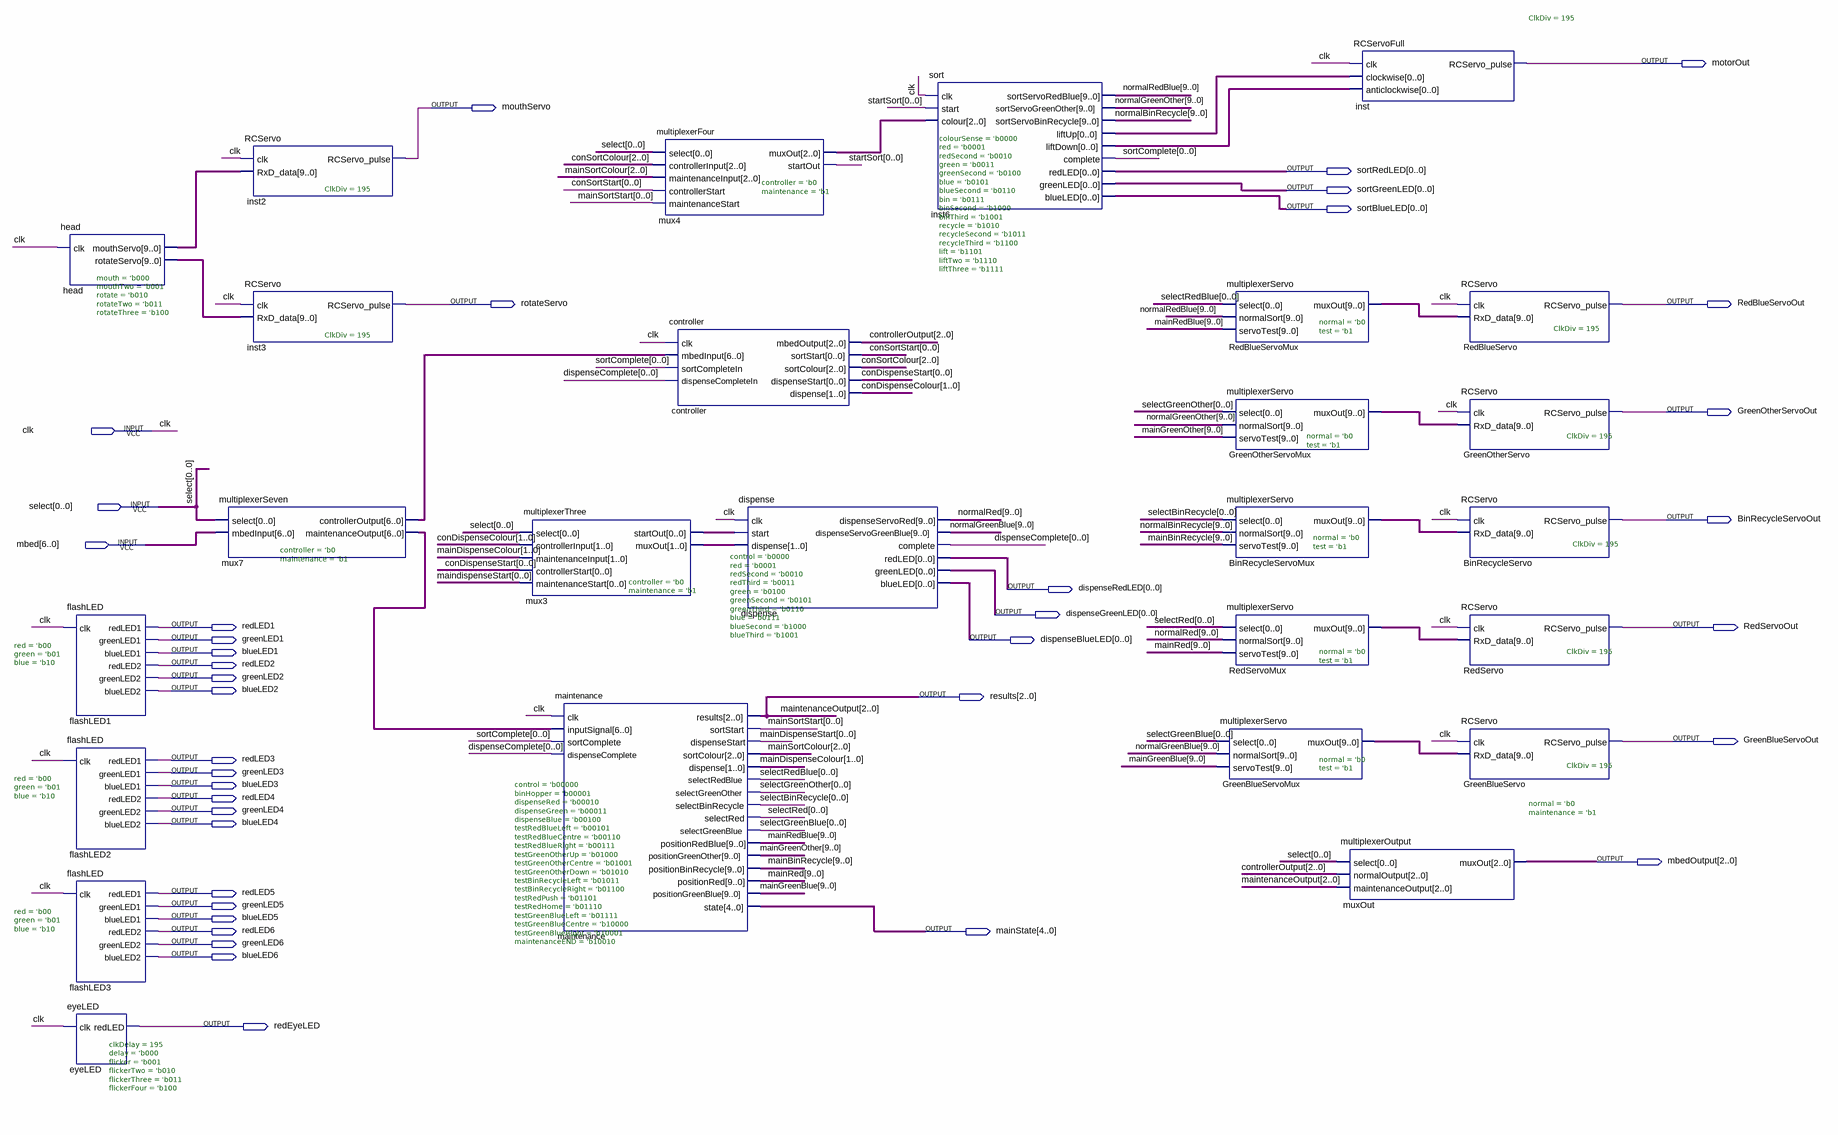
[diagram p0: schematic sheet]
// Quartus schematic System.bdf as structural Verilog: 26 symbols, 39 pins
module System (
  input  clk,
  input  [0:0] select,
  input  [6:0] mbed,
  output motorOut,
  output mouthServo,
  output [0:0] sortRedLED,
  output [0:0] sortGreenLED,
  output [0:0] sortBlueLED,
  output rotateServo,
  output RedBlueServoOut,
  output GreenOtherServoOut,
  output BinRecycleServoOut,
  output [0:0] dispenseRedLED,
  output [0:0] dispenseGreenLED,
  output redLED1,
  output RedServoOut,
  output greenLED1,
  output [0:0] dispenseBlueLED,
  output blueLED1,
  output redLED2,
  output greenLED2,
  output blueLED2,
  output [2:0] results,
  output GreenBlueServoOut,
  output redLED3,
  output greenLED3,
  output blueLED3,
  output redLED4,
  output greenLED4,
  output blueLED4,
  output [2:0] mbedOutput,
  output redLED5,
  output greenLED5,
  output blueLED5,
  output redLED6,
  output [4:0] mainState,
  output greenLED6,
  output blueLED6,
  output redEyeLED
);

  wire inst6_liftdown, inst6_liftup, mux3_startout;
  wire [0:0] conDispenseStart, conSortStart, dispenseComplete, maindispenseStart, mainSortStart,
       selectBinRecycle, selectGreenBlue, selectGreenOther, selectRed, selectRedBlue, sortComplete, startSort;
  wire [1:0] conDispenseColour, mainDispenseColour, mux3_muxout;
  wire [2:0] conSortColour, controllerOutput, mainSortColour, mux4_muxout;
  wire [6:0] mux7_controlleroutput, mux7_maintenanceoutput;
  wire [9:0] BinRecycleServoMux_muxout, GreenBlueServoMux_muxout, GreenOtherServoMux_muxout, head_mouthservo,
       head_rotateservo, mainBinRecycle, mainGreenBlue, mainGreenOther, mainRed, mainRedBlue,
       normalBinRecycle, normalGreenBlue, normalGreenOther, normalRed, normalRedBlue, RedBlueServoMux_muxout,
       RedServoMux_muxout;

  head #(.mouth('b000), .mouthTwo('b001), .rotate('b010), .rotateTwo('b011), .rotateThree('b100)) head (
    .clk(clk), .mouthServo(head_mouthservo), .rotateServo(head_rotateservo));
  flashLED #(.red('b00), .green('b01), .blue('b10)) flashLED1 (
    .clk(clk), .redLED1(redLED1), .greenLED1(greenLED1), .blueLED1(blueLED1), .redLED2(redLED2),
    .greenLED2(greenLED2), .blueLED2(blueLED2));
  flashLED #(.red('b00), .green('b01), .blue('b10)) flashLED2 (
    .clk(clk), .redLED1(redLED3), .greenLED1(greenLED3), .blueLED1(blueLED3), .redLED2(redLED4),
    .greenLED2(greenLED4), .blueLED2(blueLED4));
  flashLED #(.red('b00), .green('b01), .blue('b10)) flashLED3 (
    .clk(clk), .redLED1(redLED5), .greenLED1(greenLED5), .blueLED1(blueLED5), .redLED2(redLED6),
    .greenLED2(greenLED6), .blueLED2(blueLED6));
  eyeLED #(.clkDelay(195), .delay('b000), .flicker('b001), .flickerTwo('b010), .flickerThree('b011), .flickerFour('b100)) eyeLED (
    .clk(clk), .redLED(redEyeLED));
  multiplexerSeven #(.controller('b0), .maintenance('b1)) mux7 (
    .select(select[0]), .mbedInput(mbed), .controllerOutput(mux7_controlleroutput),
    .maintenanceOutput(mux7_maintenanceoutput));
  RCServo #(.ClkDiv(195)) inst2 (.clk(clk), .RxD_data(head_mouthservo), .RCServo_pulse(mouthServo));
  RCServo #(.ClkDiv(195)) inst3 (.clk(clk), .RxD_data(head_rotateservo), .RCServo_pulse(rotateServo));
  multiplexerThree #(.controller('b0), .maintenance('b1)) mux3 (
    .select(select[0]), .controllerInput(conDispenseColour), .maintenanceInput(mainDispenseColour),
    .controllerStart(conDispenseStart[0]), .maintenanceStart(maindispenseStart[0]), .startOut(mux3_startout),
    .muxOut(mux3_muxout));
  maintenance #(.control('b00000), .binHopper('b00001), .dispenseRed('b00010), .dispenseGreen('b00011), .dispenseBlue('b00100), .testRedBlueLeft('b00101), .testRedBlueCentre('b00110), .testRedBlueRight('b00111), .testGreenOtherUp('b01000), .testGreenOtherCentre('b01001), .testGreenOtherDown('b01010), .testBinRecycleLeft('b01011), .testBinRecycleRight('b01100), .testRedPush('b01101), .testRedHome('b01110), .testGreenBlueLeft('b01111), .testGreenBlueCentre('b10000), .testGreenBlueRight('b10001), .maintenanceEND('b10010)) maintenance (
    .clk(clk), .inputSignal(mux7_maintenanceoutput), .sortComplete(sortComplete[0]),
    .dispenseComplete(dispenseComplete[0]), .results(results), .sortStart(mainSortStart[0]),
    .dispenseStart(maindispenseStart[0]), .sortColour(mainSortColour), .dispense(mainDispenseColour),
    .selectRedBlue(selectRedBlue[0]), .selectGreenOther(selectGreenOther[0]),
    .selectBinRecycle(selectBinRecycle[0]), .selectRed(selectRed[0]), .selectGreenBlue(selectGreenBlue[0]),
    .positionRedBlue(mainRedBlue), .positionGreenOther(mainGreenOther), .positionBinRecycle(mainBinRecycle),
    .positionRed(mainRed), .positionGreenBlue(mainGreenBlue), .state(mainState));
  multiplexerFour #(.controller('b0), .maintenance('b1)) mux4 (
    .select(select[0]), .controllerInput(conSortColour), .maintenanceInput(mainSortColour),
    .controllerStart(conSortStart[0]), .maintenanceStart(mainSortStart[0]), .muxOut(mux4_muxout),
    .startOut(startSort[0]));
  controller controller (
    .clk(clk), .mbedInput(mux7_controlleroutput), .sortCompleteIn(sortComplete[0]),
    .dispenseCompleteIn(dispenseComplete[0]), .mbedOutput(controllerOutput), .sortStart(conSortStart[0]),
    .sortColour(conSortColour), .dispenseStart(conDispenseStart[0]), .dispense(conDispenseColour));
  dispense #(.control('b0000), .red('b0001), .redSecond('b0010), .redThird('b0011), .green('b0100), .greenSecond('b0101), .greenThird('b0110), .blue('b0111), .blueSecond('b1000), .blueThird('b1001)) dispense (
    .clk(clk), .start(mux3_startout), .dispense(mux3_muxout), .dispenseServoRed(normalRed),
    .dispenseServoGreenBlue(normalGreenBlue), .complete(dispenseComplete[0]), .redLED(dispenseRedLED[0]),
    .greenLED(dispenseGreenLED[0]), .blueLED(dispenseBlueLED[0]));
  sort #(.colourSense('b0000), .red('b0001), .redSecond('b0010), .green('b0011), .greenSecond('b0100), .blue('b0101), .blueSecond('b0110), .bin('b0111), .binSecond('b1000), .binThird('b1001), .recycle('b1010), .recycleSecond('b1011), .recycleThird('b1100), .lift('b1101), .liftTwo('b1110), .liftThree('b1111)) inst6 (
    .clk(clk), .start(startSort[0]), .colour(mux4_muxout), .sortServoRedBlue(normalRedBlue),
    .sortServoGreenOther(normalGreenOther), .sortServoBinRecycle(normalBinRecycle), .liftUp(inst6_liftup),
    .liftDown(inst6_liftdown), .complete(sortComplete[0]), .redLED(sortRedLED[0]),
    .greenLED(sortGreenLED[0]), .blueLED(sortBlueLED[0]));
  multiplexerServo #(.normal('b0), .test('b1)) RedBlueServoMux (
    .select(selectRedBlue[0]), .normalSort(normalRedBlue), .servoTest(mainRedBlue),
    .muxOut(RedBlueServoMux_muxout));
  multiplexerServo #(.normal('b0), .test('b1)) GreenOtherServoMux (
    .select(selectGreenOther[0]), .normalSort(normalGreenOther), .servoTest(mainGreenOther),
    .muxOut(GreenOtherServoMux_muxout));
  multiplexerServo #(.normal('b0), .test('b1)) BinRecycleServoMux (
    .select(selectBinRecycle[0]), .normalSort(normalBinRecycle), .servoTest(mainBinRecycle),
    .muxOut(BinRecycleServoMux_muxout));
  multiplexerServo #(.normal('b0), .test('b1)) RedServoMux (
    .select(selectRed[0]), .normalSort(normalRed), .servoTest(mainRed), .muxOut(RedServoMux_muxout));
  multiplexerServo #(.normal('b0), .test('b1)) GreenBlueServoMux (
    .select(selectGreenBlue[0]), .normalSort(normalGreenBlue), .servoTest(mainGreenBlue),
    .muxOut(GreenBlueServoMux_muxout));
  multiplexerOutput #(.normal('b0), .maintenance('b1)) muxOut (
    .select(select[0]), .normalOutput(controllerOutput), .maintenanceOutput(results), .muxOut(mbedOutput));
  RCServoFull #(.ClkDiv(195)) inst (
    .clk(clk), .clockwise(inst6_liftup), .anticlockwise(inst6_liftdown), .RCServo_pulse(motorOut));
  RCServo #(.ClkDiv(195)) RedBlueServo (.clk(clk), .RxD_data(RedBlueServoMux_muxout), .RCServo_pulse(RedBlueServoOut));
  RCServo #(.ClkDiv(195)) GreenOtherServo (
    .clk(clk), .RxD_data(GreenOtherServoMux_muxout), .RCServo_pulse(GreenOtherServoOut));
  RCServo #(.ClkDiv(195)) BinRecycleServo (
    .clk(clk), .RxD_data(BinRecycleServoMux_muxout), .RCServo_pulse(BinRecycleServoOut));
  RCServo #(.ClkDiv(195)) RedServo (.clk(clk), .RxD_data(RedServoMux_muxout), .RCServo_pulse(RedServoOut));
  RCServo #(.ClkDiv(195)) GreenBlueServo (
    .clk(clk), .RxD_data(GreenBlueServoMux_muxout), .RCServo_pulse(GreenBlueServoOut));

  // Other names for the same wires on the sheet: maintenanceOutput[2:0] = results
endmodule
